# EAGLE design Dashcam_HAT (EAGLE 6.6.0)

## Sheet 1 of 2
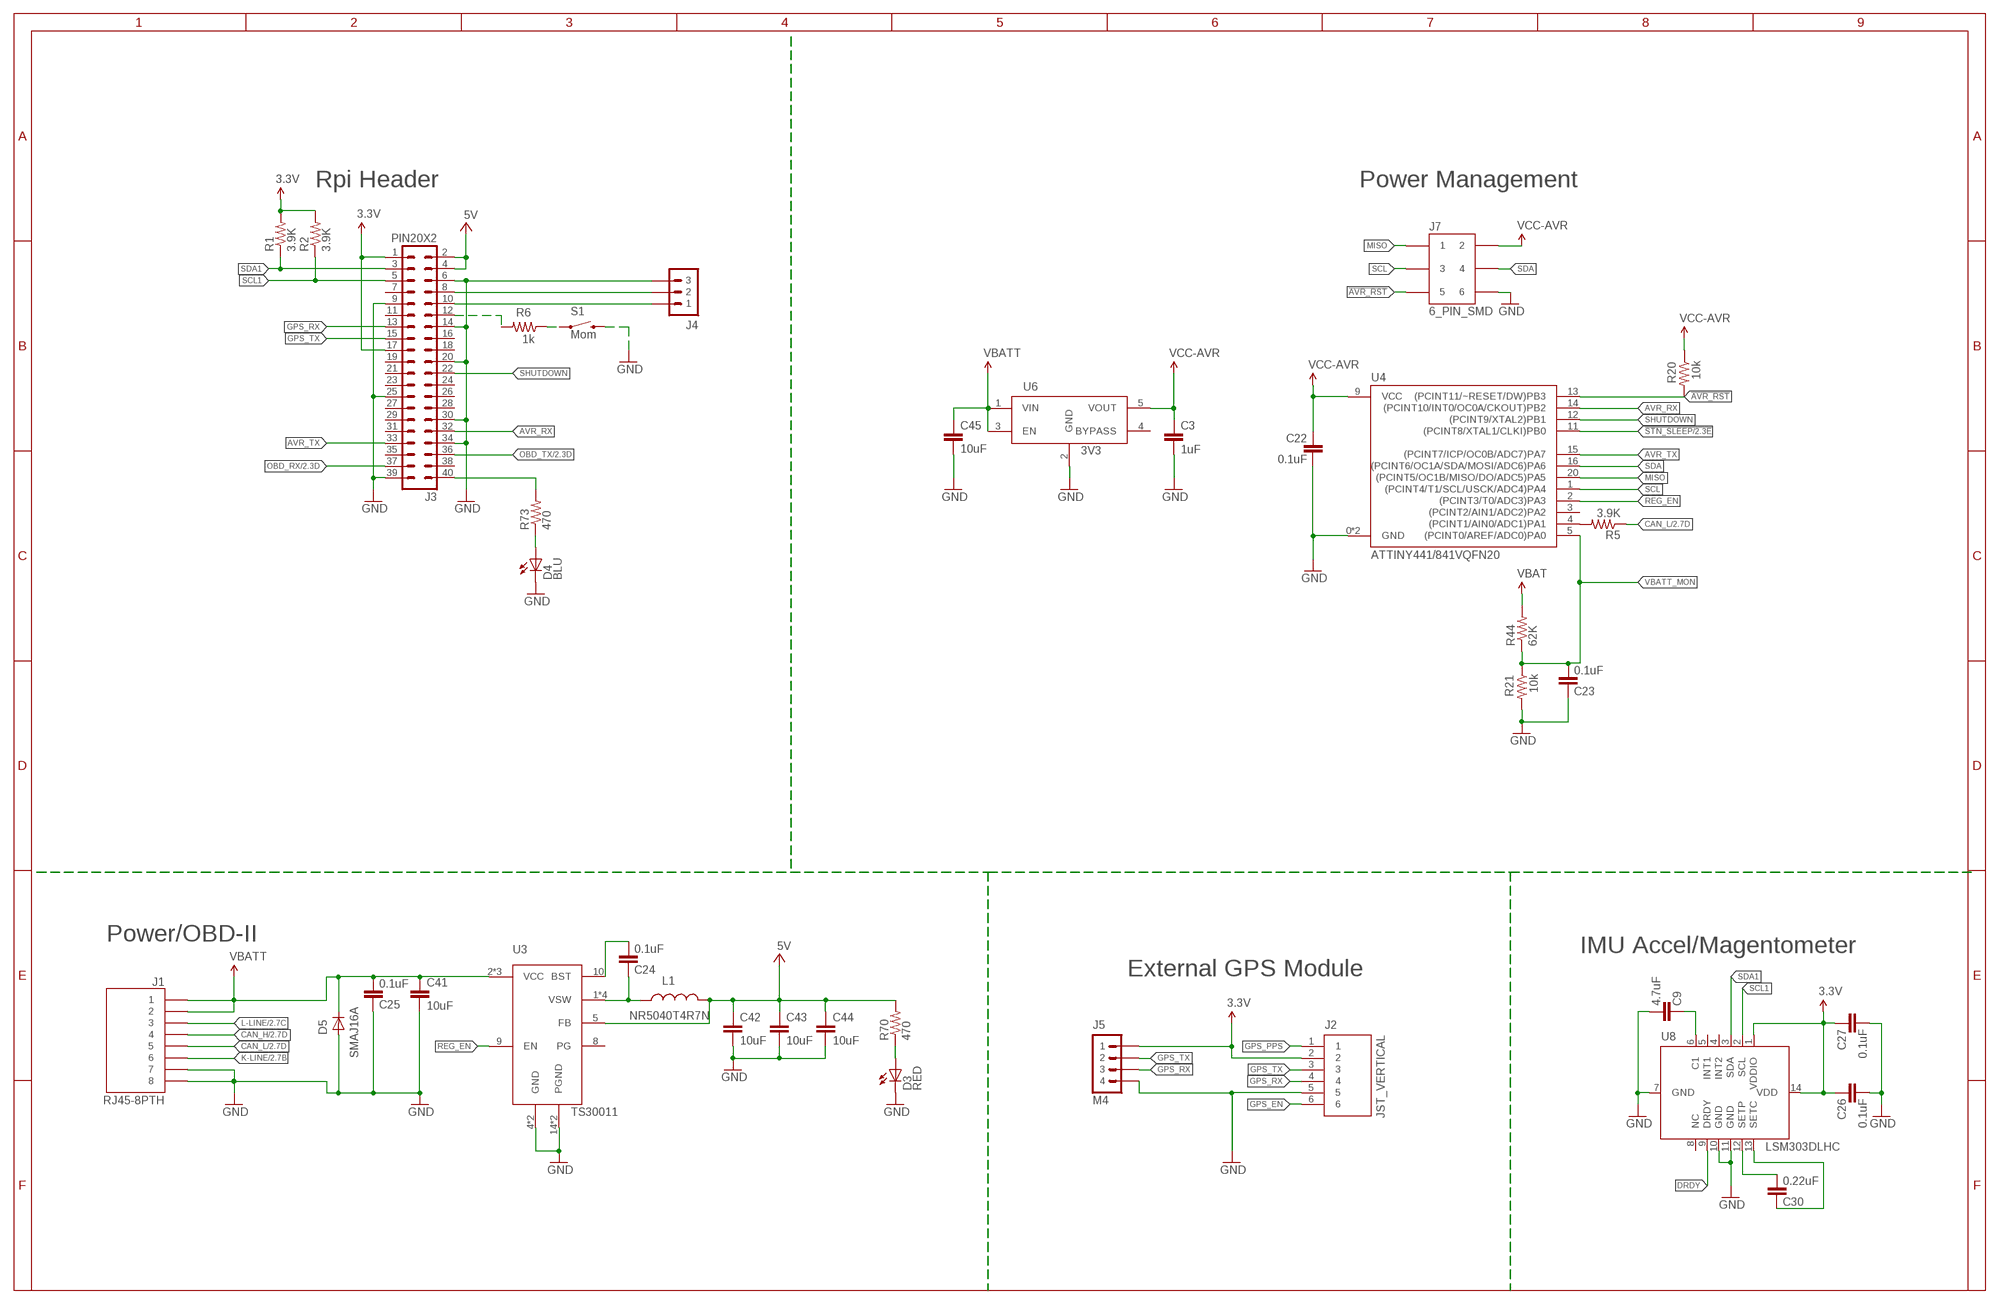
[diagram p0: schematic, sheet 1]

### Parts
C3  1uF  CAP0402-CAP  [0402-CAP]
C9  4.7uF  CAP0402-CAP  [0402-CAP]
C22  0.1uF  CAP0402-CAP  [0402-CAP]
C23  0.1uF  CAP0402-CAP  [0402-CAP]
C24  0.1uF  CAP0402-CAP  [0402-CAP]
C25  0.1uF  CAP0402-CAP  [0402-CAP]
C26  0.1uF  CAP0402-CAP  [0402-CAP]
C27  0.1uF  CAP0402-CAP  [0402-CAP]
C30  0.22uF  CAP0402-CAP  [0402-CAP]
C41  10uF  CAP1206  [1206]
C42  10uF  CAP1206  [1206]
C43  10uF  CAP1206  [1206]
C44  10uF  CAP1206  [1206]
C45  10uF  CAP1206  [1206]
D3  RED  LED0603  [LED_0603]
D4  BLU  LED0603  [LED_0603]
D5  SMAJ16A  DIODESMA  [SMA]
J1  RJ45-8PTH  [RJ45-8]
J2  JST_VERTICAL  [JST-6-SMD-VERT-1.0MM]
J3  PIN20X2  [PIN_20X2]
J4  M30.1"_LOCK  [M3X1_LOCK]
J5  M4  [M4X1_LOCK]
J7  6_PIN_SMD  6_PIN_PDISMD  [M3X2_SMD]
L1  NR5040T4R7N  [NR5040]
R1  3.9K  RESISTOR0402-RES  [0402-RES]
R2  3.9K  RESISTOR0402-RES  [0402-RES]
R5  3.9K  RESISTOR0402-RES  [0402-RES]
R6  1k  RESISTOR0402-RES  [0402-RES]
R20  10k  RESISTOR0402-RES  [0402-RES]
R21  10k  RESISTOR0402-RES  [0402-RES]
R44  62K  RESISTOR0402-RES  [0402-RES]
R70  470  RESISTOR0603-RES  [0603-RES]
R73  470  RESISTOR0603-RES  [0603-RES]
S1  Mom  SWITCH-MOMENTARY-2-SMD-1101NE  [TACTILE-SWITCH-1101NE]
U3  TS30011  [QFN-16]
U4  ATTINY441/841VQFN20  [QFN20_0.45MM]
U6  3V3  TC1XXXSOT23-5  [SOT23-5]
U8  LSM303DLHC  [LGA14]

### Nets
3.3V: C26.1 C27.1 J2.2 J3.1 J3.17 J5.1 R1.2 R2.2 U8.1(VDDIO) U8.14(VDD) ; also sheet 2
5V: C42.1 C43.1 C44.1 J3.2 J3.4 L1.P$2 R70.2 U3.5(FB) ; also sheet 2
!AVR_RST: J7.P$5 R20.2 U4.13((PCINT11/~RESET/DW)PB3)
!STN_SLEEP: U4.11((PCINT8/XTAL1/CLKI)PB0) ; also sheet 2
AVR_RX: J3.32 U4.14((PCINT10/INT0/OC0A/CKOUT)PB2)
AVR_TX: J3.33 U4.15((PCINT7/ICP/OC0B/ADC7)PA7)
BST: C24.2 U3.10(BST)
CAN_H: J1.4 ; also sheet 2
CAN_L: J1.5 R5.1 ; also sheet 2
DRDY: U8.9(DRDY)
GND: C3.2 C9.2 C22.2 C23.1 C25.1 C26.2 C27.2 C41.2 C42.2 C43.2 C44.2 C45.2 D3.C D4.C D5.A J1.7 J1.8 J2.5 J3.6 J3.9 J3.14 J3.20 J3.25 J3.30 J3.34 J3.39 J4.3 J5.4 J7.P$6 R21.2 S1.P$2 U3.4(GND) U3.14(PGND) U3.15(PGND) U3.EXP(GND) U4.0(GND) U4.8(GND) U6.2(GND) U8.7(GND) U8.10(GND) U8.11(GND) ; also sheet 2
GPS_EN: J2.6
GPS_PPS: J2.1
GPS_RX: J2.4 J3.13 J5.3
GPS_TX: J2.3 J3.15 J5.2
K-LINE: J1.6 ; also sheet 2
L-LINE: J1.3 ; also sheet 2
MISO: J7.P$1 U4.20((PCINT5/OC1B/MISO/DO/ADC5)PA5)
N$1: C9.1 U8.6(C1)
N$2: R5.2 U4.4((PCINT1/AIN0/ADC1)PA1)
N$12: D3.A R70.1
N$17: D4.A R73.1
N$18: C30.2 U8.12(SETP)
N$20: C30.1 U8.13(SETC)
N$23: J3.12 R6.2
N$24: R6.1 S1.P$1
OBD_RX: J3.37 ; also sheet 2
OBD_TX: J3.36 ; also sheet 2
REG_EN: U3.9(EN) U4.2((PCINT3/T0/ADC3)PA3)
SCL: J7.P$3 U4.1((PCINT4/T1/SCL/USCK/ADC4)PA4)
SCL1: J3.5 R2.1 U8.2(SCL)
SDA: J7.P$4 U4.16((PCINT6/OC1A/SDA/MOSI/ADC6)PA6)
SDA1: J3.3 R1.1 U8.3(SDA)
SHUTDOWN: J3.22 U4.12((PCINT9/XTAL2)PB1)
UART1_RX: J3.10 J4.1
UART1_TX: J3.8 J4.2
USER_LED: J3.40 R73.2
VBATT [VBATT]: C25.2 C41.1 C45.1 D5.K(C) J1.1 J1.2 R44.2 U3.2(VCC) U3.3(VCC) U3.11(VCC) U6.1(VIN) U6.3(EN) ; supply symbol labelled VBAT ; also sheet 2
VBATT_MON: C23.2 R21.1 R44.1 U4.5((PCINT0/AREF/ADC0)PA0)
VCC-AVR: C3.1 C22.1 J7.P$2 R20.1 U4.9(VCC) U6.5(VOUT)
VSW: C24.1 L1.P$1 U3.1(VSW) U3.12(VSW) U3.13(VSW) U3.16(VSW)
Unconnected: J3.7 J3.11 J3.16 J3.18 J3.19 J3.21 J3.23 J3.24 J3.26 J3.27 J3.28 J3.29 J3.31 J3.35 J3.38 U3.8(PG) U4.3((PCINT2/AIN1/ADC2)PA2) U6.4(BYPASS) U8.4(INT2) U8.5(INT1) U8.8(NC)

### Notes on the sheet
- Rpi Header | Power Management
- Power/OBD-II
- IMU Accel/Magentometer
- External GPS Module
- X

## Sheet 2 of 2
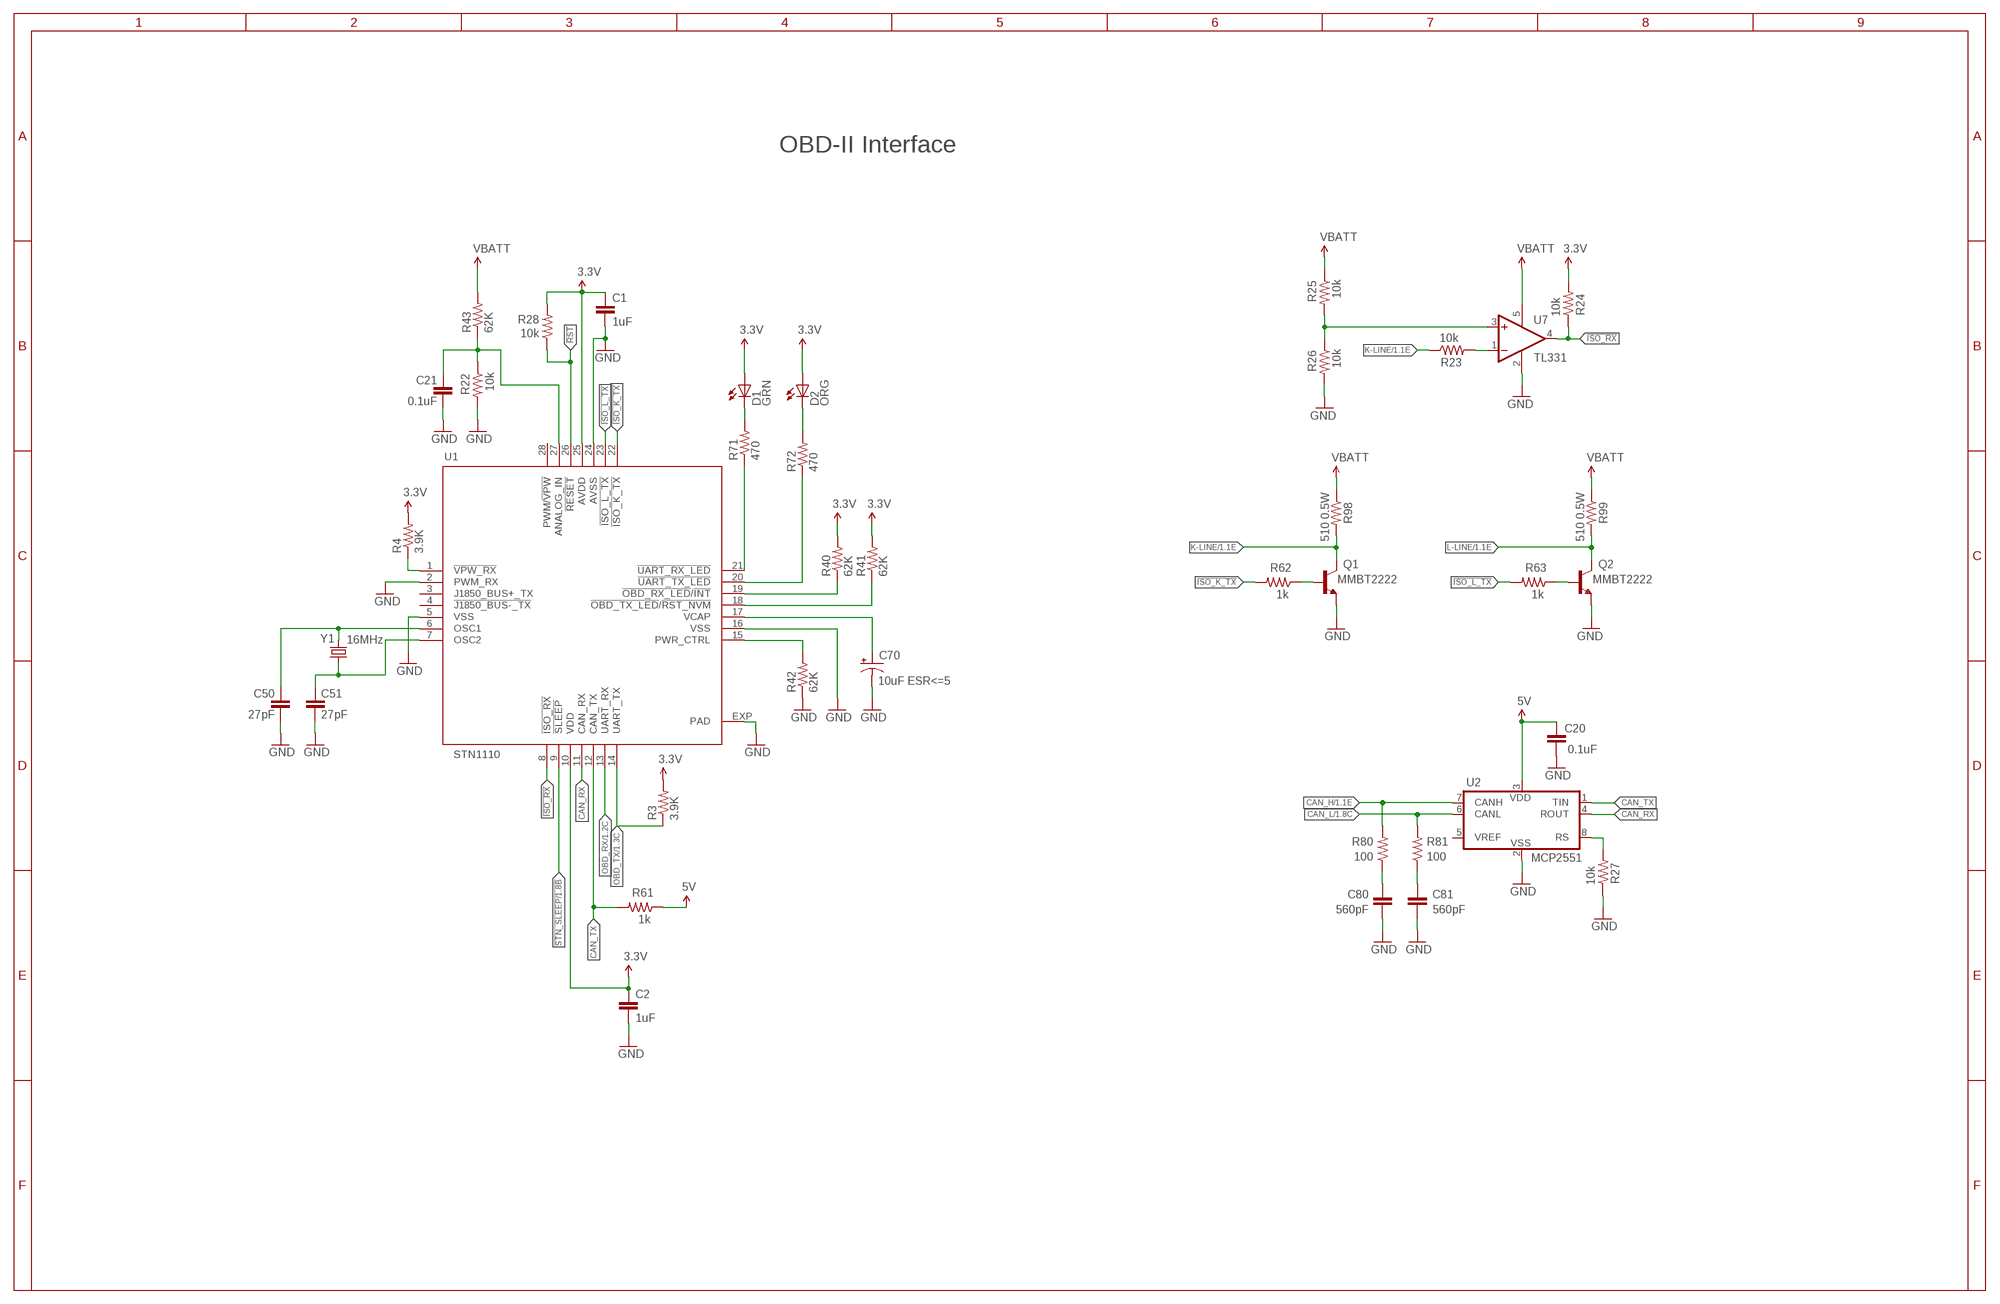
[diagram p1: schematic, sheet 2]

### Parts
C1  1uF  CAP0402-CAP  [0402-CAP]
C2  1uF  CAP0402-CAP  [0402-CAP]
C20  0.1uF  CAP0402-CAP  [0402-CAP]
C21  0.1uF  CAP0402-CAP  [0402-CAP]
C50  27pF  CAP0402-CAP  [0402-CAP]
C51  27pF  CAP0402-CAP  [0402-CAP]
C70  10uF ESR<=5  CAP_POL1206  [EIA3216]
C80  560pF  CAP0402-CAP  [0402-CAP]
C81  560pF  CAP0402-CAP  [0402-CAP]
D1  GRN  LED0603  [LED_0603]
D2  ORG  LED0603  [LED_0603]
Q1  MMBT2222  TRANSISTOR_NPNSOT23-3  [SOT23-3]
Q2  MMBT2222  TRANSISTOR_NPNSOT23-3  [SOT23-3]
R3  3.9K  RESISTOR0402-RES  [0402-RES]
R4  3.9K  RESISTOR0402-RES  [0402-RES]
R22  10k  RESISTOR0402-RES  [0402-RES]
R23  10k  RESISTOR0402-RES  [0402-RES]
R24  10k  RESISTOR0402-RES  [0402-RES]
R25  10k  RESISTOR0402-RES  [0402-RES]
R26  10k  RESISTOR0402-RES  [0402-RES]
R27  10k  RESISTOR0402-RES  [0402-RES]
R28  10k  RESISTOR0402-RES  [0402-RES]
R40  62K  RESISTOR0402-RES  [0402-RES]
R41  62K  RESISTOR0402-RES  [0402-RES]
R42  62K  RESISTOR0402-RES  [0402-RES]
R43  62K  RESISTOR0402-RES  [0402-RES]
R61  1k  RESISTOR0402-RES  [0402-RES]
R62  1k  RESISTOR0402-RES  [0402-RES]
R63  1k  RESISTOR0402-RES  [0402-RES]
R71  470  RESISTOR0603-RES  [0603-RES]
R72  470  RESISTOR0603-RES  [0603-RES]
R80  100  RESISTOR0402-RES  [0402-RES]
R81  100  RESISTOR0402-RES  [0402-RES]
R98  510 0.5W  R-US_2010  [2010]
R99  510 0.5W  R-US_2010  [2010]
U1  STN1110  SCANTOOL  [_STN_SCANTOOL_QFN-28-S]
U2  MCP2551  MCP2551-I/SN  [SO-8]
U7  TL331  [DBV-R-PDSO-G5]
Y1  16MHz  CRYSTAL5X3  [CRYSTAL-SMD-5X3]

### Nets
3.3V: C1.1 C2.1 D1.A D2.A R3.2 R4.2 R24.2 R28.2 R40.2 R41.2 U1.10(VDD) U1.25(AVDD) ; also sheet 1
5V: C20.1 R61.1 U2.3(VDD) ; also sheet 1
!ISO_K_TX: R62.2 U1.22(!ISO_K_TX)
!ISO_L_TX: R63.2 U1.23(!ISO_L_TX)
!ISO_RX: R24.1 U1.8(!ISO_RX) U7.4(OUT)
!RST: R28.1 U1.26(!RESET)
!STN_SLEEP: U1.9(!SLEEP) ; also sheet 1
BATT_V: C21.1 R22.1 R43.1 U1.27(ANALOG_IN)
CAN_H: R80.2 U2.7(CANH) ; also sheet 1
CAN_L: R81.2 U2.6(CANL) ; also sheet 1
CAN_RX: U1.11(CAN_RX) U2.4(ROUT)
CAN_TX: R61.2 U1.12(CAN_TX) U2.1(TIN)
GND: C1.2 C2.2 C20.2 C21.2 C50.2 C51.2 C70.C(-) C80.2 C81.2 Q1.2(E) Q2.2(E) R22.2 R26.2 R27.1 R42.1 U1.2(PWM_RX) U1.5(VSS) U1.16(VSS) U1.24(AVSS) U1.EXP(PAD) U2.2(VSS) U7.2(GND) ; also sheet 1
K-LINE: Q1.3(C) R23.1 R98.2 ; also sheet 1
L-LINE: Q2.3(C) R99.2 ; also sheet 1
N$3: R71.1 U1.21(!UART_RX_LED)
N$4: Q1.1(B) R62.1
N$5: Q2.1(B) R63.1
N$6: R25.2 R26.1 U7.3(+IN)
N$7: R72.1 U1.20(!UART_TX_LED)
N$8: R42.2 U1.15(PWR_CTRL)
N$9: R4.1 U1.1(!VPW_RX)
N$10: C80.1 R80.1
N$11: R27.2 U2.8(RS)
N$13: R23.2 U7.1(-IN)
N$14: R41.1 U1.18(!OBD_TX_LED!/!RST_NVM)
N$15: R40.1 U1.19(!OBD_RX_LED!/!INT)
N$26: C70.A(+) U1.17(VCAP)
N$27: C81.1 R81.1
N$35: D1.C R71.2
N$36: D2.C R72.2
OBD_RX: U1.13(UART_RX) ; also sheet 1
OBD_TX: R3.1 U1.14(UART_TX) ; also sheet 1
OSC1: C50.1 U1.6(OSC1) Y1.3
OSC2: C51.1 U1.7(OSC2) Y1.1
VBATT [VBATT]: R25.1 R43.2 R98.1 R99.1 U7.5(V+) ; also sheet 1
Unconnected: U1.3(J1850_BUS+_TX) U1.4(!J1850_BUS-_TX) U1.28(PWM/!VPW) U2.5(VREF)

### Notes on the sheet
- OBD-II Interface

## Library data of the parts
C1-C3 = SparkFun:CAP: Capacitor Standard 0603 ceramic capacitor, and 0.1" leaded capacitor.; DIGIKEY_PN: 490-3890-1-ND; MANUFACTURER: Murata; MFG_PN: GRM155R61A105KE15D
C9 = SparkFun:CAP: Capacitor Standard 0603 ceramic capacitor, and 0.1" leaded capacitor.; DIGIKEY_PN: 490-5915-1-ND; MANUFACTURER: Murata; MFG_PN: GRM155R60J475ME47D
C20-C27 = SparkFun:CAP: Capacitor Standard 0603 ceramic capacitor, and 0.1" leaded capacitor.; DIGIKEY_PN: 1276-1001-1-ND; MANUFACTURER: Samsung; MFG_PN: CL05B104KO5NNNC
C30 = SparkFun:CAP: Capacitor Standard 0603 ceramic capacitor, and 0.1" leaded capacitor.; DIGIKEY_PN: 490-5418-1-ND; MANUFACTURER: Murata; MFG_PN: GRM155R71C224KA12D
C41-C45 = SparkFun-Capacitors:CAP: Capacitor Standard 0603 ceramic capacitor, and 0.1" leaded capacitor.; DIGIKEY_PN: 1276-6767-1-ND; MANUFACTURER: Samsung; MFG_PN: CL31B106KBHNNNE
C50 = SparkFun:CAP: Capacitor Standard 0603 ceramic capacitor, and 0.1" leaded capacitor.; DIGIKEY_PN: 1276-1153-1-ND; MANUFACTURER: Samsung; MFG_PN: CL05C270JB5NNNC
C51 = SparkFun:CAP: Capacitor Standard 0603 ceramic capacitor, and 0.1" leaded capacitor.
C70 = SparkFun:CAP_POL: Capacitor Polarized These are standard SMD and PTH capacitors. Normally 10uF, 47uF, and 100uF in electrolytic and tantalum varieties. Always verify the external diameter of the through hole cap, it varies with capacity, voltage, and manufacturer. The EIA devices should be standard.; DIGIKEY_PN: 478-8237-1-ND; MANUFACTURER: AVX Corporation; MFG_PN: F931C106MAA
C80 C81 = SparkFun:CAP: Capacitor Standard 0603 ceramic capacitor, and 0.1" leaded capacitor.; DIGIKEY_PN: 1276-1577-1-ND; MANUFACTURER: Samsung; MFG_PN: CL05B561KB5NNNC
D1 = Jason_Library_1:LED: Surface mount LED; DIGIKEY_PN: 160-1183-1-ND; MANUFACTURER: Lite-On Inc; MFG_PN: LTST-C190GKT
D2 = Jason_Library_1:LED: Surface mount LED; DIGIKEY_PN: 160-1434-1-ND; MANUFACTURER: Lite-On Inc; MFG_PN: LTST-C190KFKT
D3 = Jason_Library_1:LED: Surface mount LED; DIGIKEY_PN: 160-1436-1-ND; MANUFACTURER: Lite-On Inc; MFG_PN: LTST-C190KRKT
D4 = Jason_Library_1:LED: Surface mount LED; DIGIKEY_PN: 160-1646-1-ND; MANUFACTURER: Lite-On Inc; MFG_PN: LTST-C190TBKT
D5 = Jason_Library_1:DIODE: General purpose diode; DIGIKEY_PN: SMAJ16ALFCT-ND; MANUFACTURER: Littlefuse; MFG_PN: SMAJ16A
J1 = SparkFun-Connectors:RJ45-8: RJ45 Jack Simple RJ45, 8-pin connection - connector for common Cat5, Cat5e, and Cat6 Ethernet cables. Footprint not yet proven in production. Connector sku is PRT-00643; Breakout PCB sku is BOB-00716.; DIGIKEY_PN: 609-1046-ND; MANUFACTURER: Amphenol FCI; MFG_PN: 54602-908LF
J2 = SparkFun-Connectors:JST_VERTICAL; DIGIKEY_PN: 455-1792-1-ND; MANUFACTURER: JST; MFG_PN: BM06B-SRSS-TB(LF)(SN); PROD_ID: CONN-08249
J3 = FLYFISH:PIN20X2; DIGIKEY_PN: SAM9315-ND; MANUFACTURER: Samtec Inc; MFG_PN: ESQ-120-23-T-D
J4 = Jason_Connector:M3: 3 pin header
J5 = Jason_Connector:M4: 4 pin 0.1" pitch header
J7 = Jason_Connector:6_PIN_PDI: 6 pin PDI programming header; DIGIKEY_PN: 609-3693-1-ND; MANUFACTURER: Amphenol FCI; MFG_PN: 20021121-00006C4LF
L1 = Jason_Library_1:NR5040T4R7N: Taiyo Yuden Inductor Datasheet <http://ds.yuden.co.jp/TYCOMPAS/ut/detail.do?productNo=NR5040T4R7N&fileName=NR5040T4R7N_SS&mode=specSheetDownload>; DIGIKEY_PN: 587-2373-1-ND; MANUFACTURER: Taiyo Yuden; MFG_PN: 587-2373-1-ND
Q1 Q2 = SparkFun:TRANSISTOR_NPN: Transistor NPN BJT configuration in SOT23 package. MMBT2222 is the common NPN we use. Double check BCE configuration again layout.; DIGIKEY_PN: MMBT2222ALT1GOSCT-ND; MANUFACTURER: ON Semiconductor; MFG_PN: MMBT2222ALT1G
R1-R5 = SparkFun-Passives:RESISTOR: Resistor Basic schematic elements and footprints for 0603, 1206, and PTH resistors.; DIGIKEY_PN: 311-3.9KJRCT-ND; MANUFACTURER: Yageo; MFG_PN: RC0402JR-073K9L
R6 R61-R63 = SparkFun:RESISTOR: Resistor Basic schematic elements and footprints for 0603, 1206, and PTH resistors.; DIGIKEY_PN: 311-1.0KJRCT-ND; MANUFACTURER: Yageo; MFG_PN: RC0402JR-071KL
R20-R27 = SparkFun:RESISTOR: Resistor Basic schematic elements and footprints for 0603, 1206, and PTH resistors.; DIGIKEY_PN: 311-10KJRCT-ND; MANUFACTURER: Yageo; MFG_PN: RC0402JR-0710KL
R28 = SparkFun:RESISTOR: Resistor Basic schematic elements and footprints for 0603, 1206, and PTH resistors.
R40-R44 = SparkFun:RESISTOR: Resistor Basic schematic elements and footprints for 0603, 1206, and PTH resistors.; DIGIKEY_PN: 311-62.0KLRCT-ND; MANUFACTURER: Yageo; MFG_PN: RC0402FR-0762KL
R70-R73 = SparkFun-Passives:RESISTOR: Resistor Basic schematic elements and footprints for 0603, 1206, and PTH resistors.; DIGIKEY_PN: 311-470JRCT-ND; MANUFACTURER: Yageo; MFG_PN: RC0402JR-07470RL
R80 R81 = SparkFun:RESISTOR: Resistor Basic schematic elements and footprints for 0603, 1206, and PTH resistors.; DIGIKEY_PN: 311-100JRCT-ND; MANUFACTURER: Yageo; MFG_PN: RC0402JR-07100RL
R98 R99 = _stn_rcl:R-US: Resistor, US Symbol Change Log Date Author Change November 13, 2006 vit@scantool.net Moved underscore from the end of device name to beginning of variant names. May 27, 2006 vitaliy@scantool.net Added description.; DESC: Resistor; DIGIKEY_PN: RHM510BGCT-ND; MANUFACTURER: Rohm Semiconductor; MFG_PN: MCR50JZHJ511; VALSTAT: VAL
S1 = SparkFun:SWITCH-MOMENTARY-2; DIGIKEY_PN: P13597SCT-ND; MANUFACTURER: Panasonic; MFG_PN: EVQ-PNF04M
U1 = SparkFun:SCANTOOL: STN1110 - Multiprotocol OBD II to UART Interpreter, QFN Package Change Log Date Author Change Aug 23, 2010 vit@scantool.net Created device
U2 = _stn_microchip:MCP2551: CAN Driver Based on information from the MPC2551 datasheet from Microchip. http://www.microchip.com/ Change Log Date Author Change November 12, 2008 joe@scantool.net Renamed "TXD" to "TIN" and "RXD" to "ROUT" Fixed mislabeled pins "CANH" and CANL"; DESC: IC, CAN Transceiver; DIGIKEY_PN: MCP2551T-E/SNCT-ND; MANUF: Microchip Technology; MANUFACTURER: Microchip Technology; MFG_PN: MCP2551T-E/SN; PARTNUM: MCP2551-I/SN; SUPPLIER: Digikey:MCP2551-I/SN-ND; VALSTAT: PARTNUM
U3 = Jason_Library_1:TS30011: Semtech High Efficiency 1A/2A/3A Current-Mode Synchronous Buck DC/DC Converter Datasheet <http://www.semtech.com/images/datasheet/ts30011_12_13.pdf>; DIGIKEY_PN: TS30013-M050QFNRCT-ND; MANUFACTURER: Semtech; MFG_PN: TS30013-M050QFNR
U4 = Jason_Library_1:ATTINY441/841: ATtiny441/841 8-bit AVR Microcontroller with 4/8K Bytes In-System Flash; DIGIKEY_PN: ATTINY841-MMH-ND; MANUFACTURER: Atmel; MFG_PN: ATTINY841-MMH
U6 = Jason_Library_1:TC1XXX: TC1014/TC1015/TC1185 voltage regulator; DIGIKEY_PN: AP2204K-3.3TRG1DICT-ND; MANUFACTURER: Diodes Inc; MFG_PN: AP2204K-3.3TRG1
U7 = linear:TL331: SINGLE DIFFERENTIAL COMPARATOR Source: Data sheet <http://www.ti.com/lit/ds/symlink/tl331-q1.pdf>; DIGIKEY_PN: 296-10168-1-ND; MANUFACTURER: Texas Instruments; MFG_PN: TL331IDBVR
U8 = microbuilder:LSM303DLHC: LSM303DLHC 3-Axis I2C Accelerometer and 3-Axis Magnetometer VDD: 2.2-3.6V VDDIO: 1.8-VDD Magnetic Range: +/-1.3 to +/-8.1 gauss Accel Range: +/-2/4/8/16 g Temp: -40 - 85°C; DIGIKEY_PN: 497-11918-1-ND; MANUFACTURER: STMicroelectronics; MFG_PN: LSM303DLHCTR
Y1 = SparkFun:CRYSTAL: Crystals Various standard crystals. Proven footprints. Spark Fun Electronics SKU : COM-00534; DIGIKEY_PN: 535-9122-1-ND; MANUFACTURER: Abracon LLC; MFG_PN: ABM3B-16.000MHZ-B2-T

## Net classes
1 VBATT: width 0.406 mm, clearance 0.254 mm

## Board
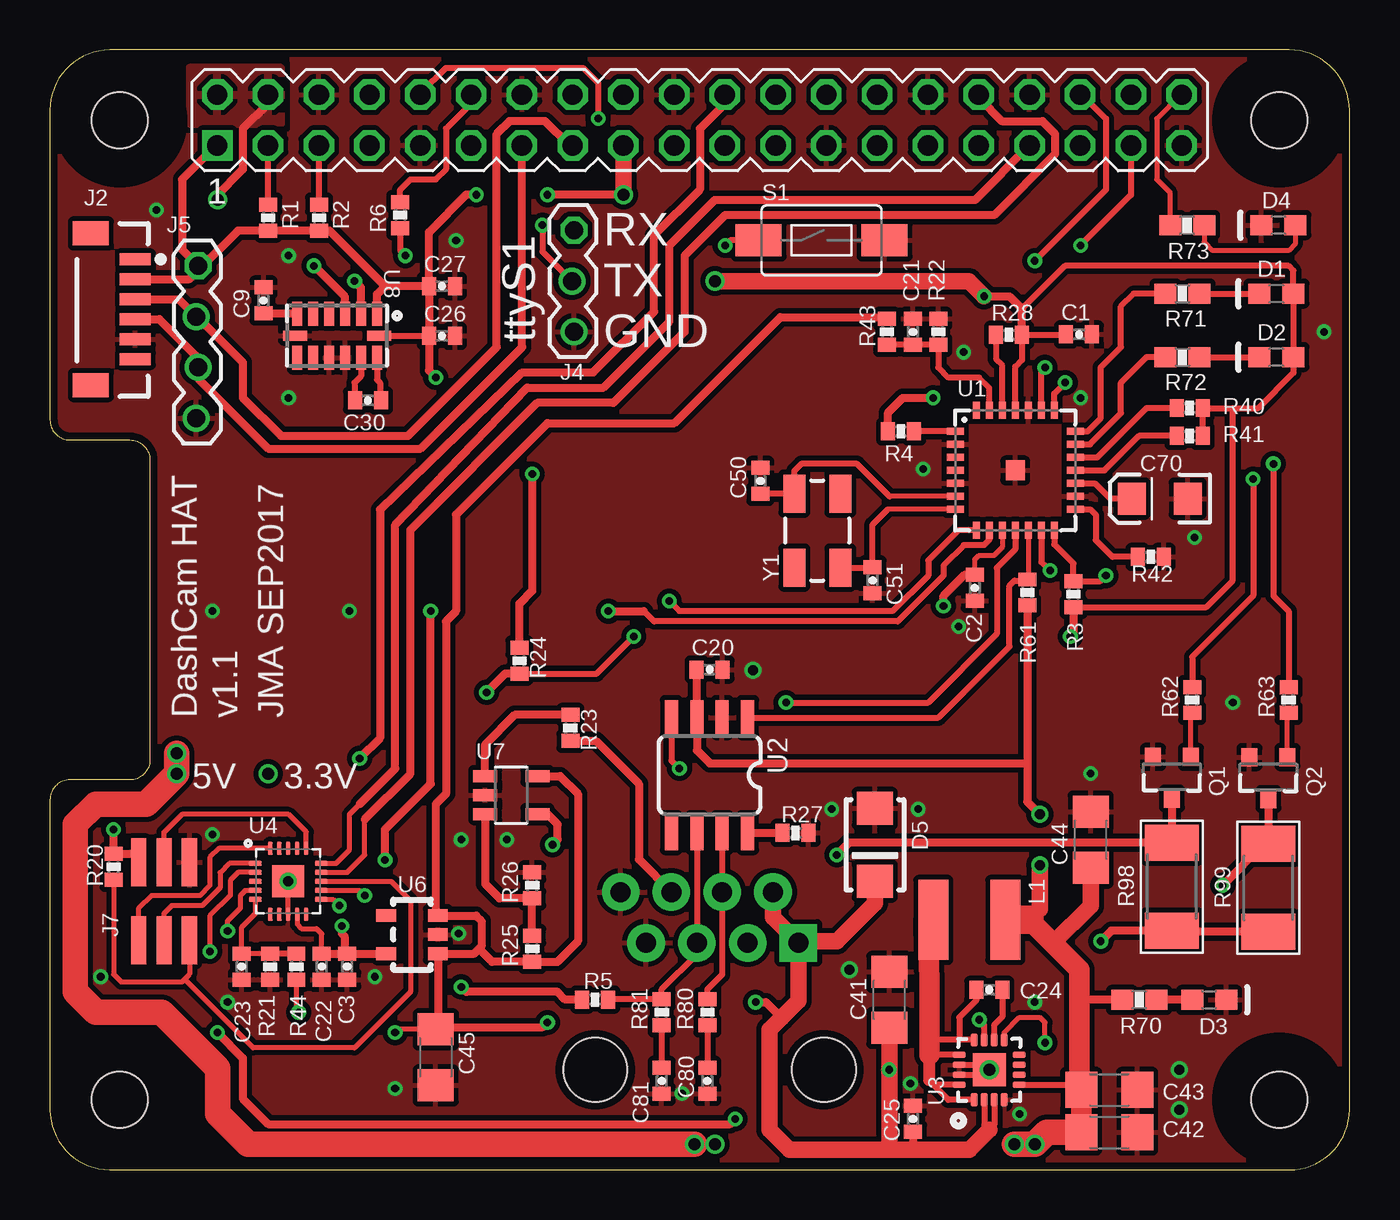
[diagram p2: board, top side]
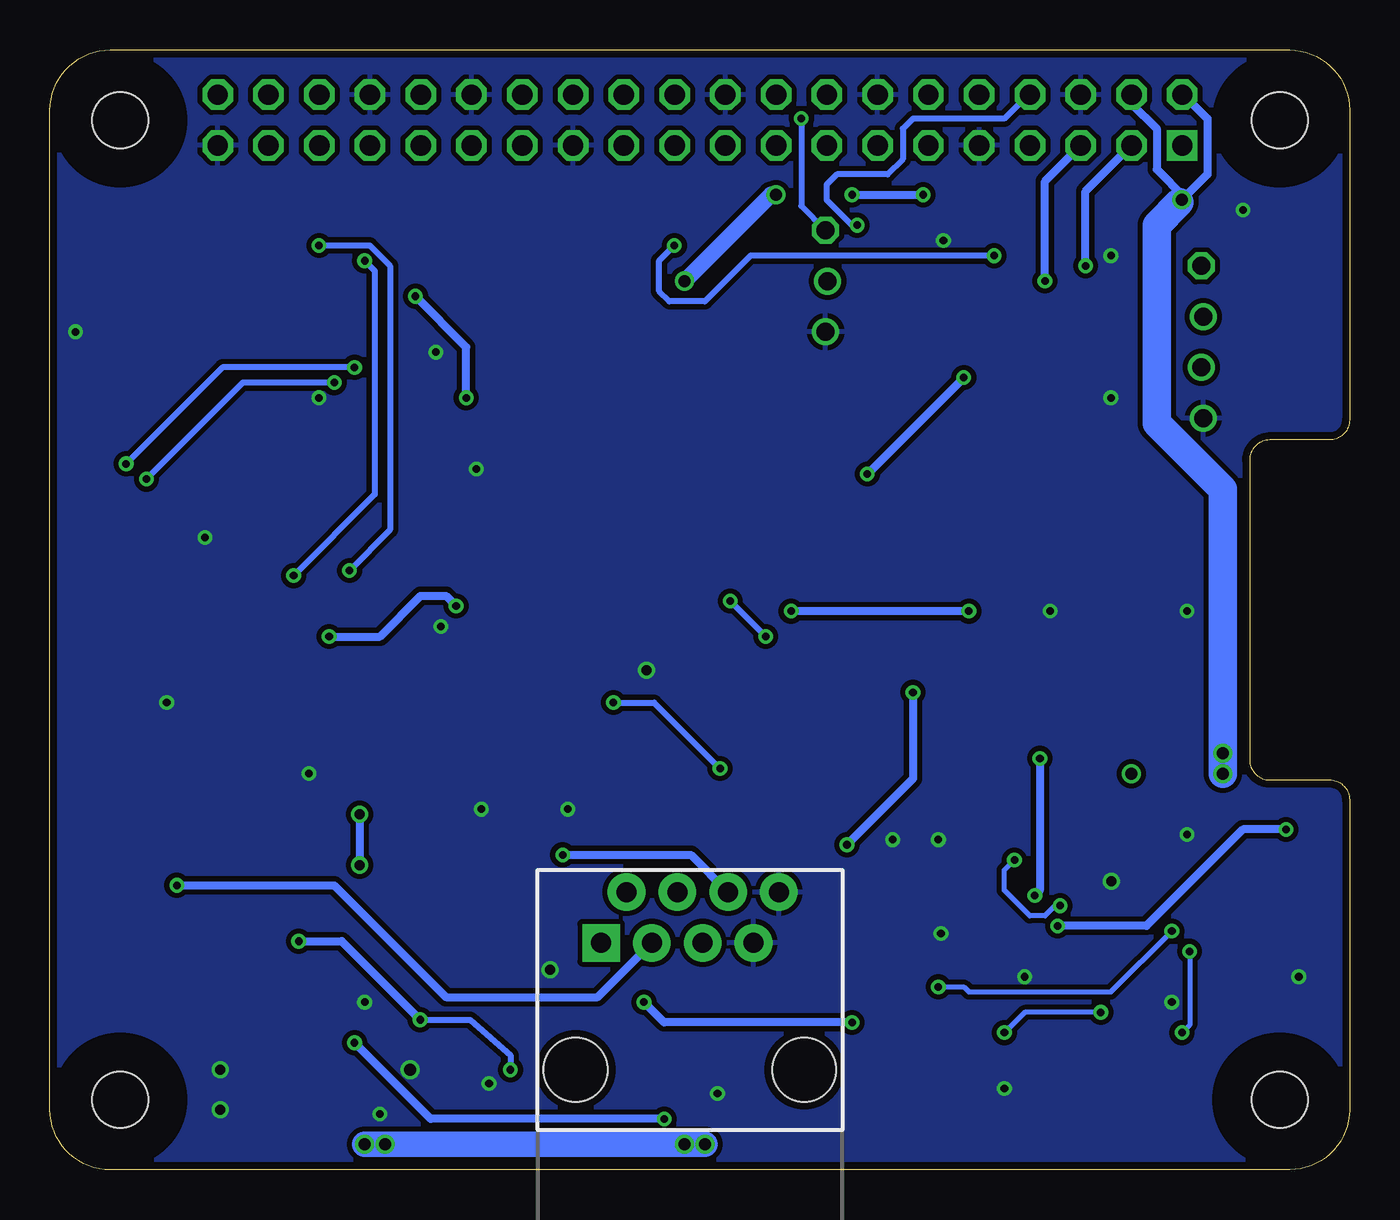
[diagram p3: board, bottom side, seen from below]

Size 65.02 x 56.01 mm. Coordinates in mm from the lower left corner, seen from the top.
Outline: 0,3 arc90 3,0 62,0 arc90 65.02,3 65.02,53 arc90 62,56.01 3,56.01 arc90 0,53 0,37.5 arc90 1,36.5 4,36.5 arc-90 5,35.5 5,20.5 arc-90 4,19.5 1,19.5 arc90 0,18.5 0,3
Copper layers (1*16): Top 0.0356mm / dielectric 1.5011mm / Bottom 0.0356mm
Design rules "oshpark-2layer *": minimum track width 6mil, minimum drill 13mil, track to track 6mil, track to pad 6mil, pad to pad 6mil, via to via 6mil, smd to smd 6mil, copper to edge 15mil, drill to drill 6mil, minimum pad ring 7mil, minimum via ring 7mil, stop-mask expansion 2.5mil, vias tented up to drill 16mil, thermal gap 10mil
Holes 2.8 mm at 3.5,3.5 3.5,52.5 61.5,52.5 61.5,3.5
bKeepout: area 43,0 to 47,20
tRestrict: area 1.9,51 to 5,54; area 60,51 to 63,54; area 60,1.9 to 63,5; area 1.9,1.9 to 5,5; area 46.3,5.8 to 47.8,6.1; area 46.2,3.9 to 47.7,4.2; area 47.8,4.2 to 48.1,5.7; area 45.9,4.3 to 46.2,5.8; area 12.7,13.7 to 13.2,15.2; area 11.2,15.2 to 12.7,15.7; area 10.7,13.7 to 11.2,15.2; area 11.2,13.2 to 12.7,13.7
bRestrict: area 1.9,1.9 to 5,5; area 1.9,51 to 5,54; area 60,1.9 to 63,5; area 60,51 to 63,54

### Footprints (pad centres in the part's own frame; a part is rotated, then mirrored left to right if it is on the bottom)
0402-CAP = smd 0.7 x 0.9: 1 -0.65,0; 2 0.65,0
1206 = smd 1.6 x 1.8: 1 -1.4,0; 2 1.4,0
EIA3216 = smd 1.4 x 1.6: A 1.4,0; C -1.4,0
LED_0603 = smd 1.1 x 1: A -0.85,0; C 0.85,0
SMA = smd 1.651 x 1.803: A 1.816,0; K -1.816,0
RJ45-8 = drill 1 pad 1.88 square: 1 -4.445,6.35 | drill 1 pad 1.88: 2 -3.175,8.89; 3 -1.905,6.35; 4 -0.635,8.89; 5 0.635,6.35; 6 1.905,8.89; 7 3.175,6.35; 8 4.445,8.89 | hole 3.2: -5.715,0; 5.715,0
JST-6-SMD-VERT-1.0MM = smd 0.6 x 1.55: 1 -2.54,1.27; 2 -1.54,1.27; 3 -0.54,1.27; 4 0.46,1.27; 5 1.46,1.27; 6 2.46,1.27 | smd 1.2 x 1.8: P$1 -3.84,-0.955; P$2 3.76,-0.955
PIN_20X2 = drill 1.016 square: 1 -24.13,-1.27 | drill 1.016 octagon: 2 -24.13,1.27; 3 -21.59,-1.27; 4 -21.59,1.27; 5 -19.05,-1.27; 6 -19.05,1.27; 7 -16.51,-1.27; 8 -16.51,1.27; 9 -13.97,-1.27; 10 -13.97,1.27; 11 -11.43,-1.27; 12 -11.43,1.27; 13 -8.89,-1.27; 14 -8.89,1.27; 15 -6.35,-1.27; 16 -6.35,1.27; 17 -3.81,-1.27; 18 -3.81,1.27; 19 -1.27,-1.27; 20 -1.27,1.27; 21 1.27,-1.27; 22 1.27,1.27; 23 3.81,-1.27; 24 3.81,1.27; 25 6.35,-1.27; 26 6.35,1.27; 27 8.89,-1.27; 28 8.89,1.27; 29 11.43,-1.27; 30 11.43,1.27; 31 13.97,-1.27; 32 13.97,1.27; 33 16.51,-1.27; 34 16.51,1.27; 35 19.05,-1.27; 36 19.05,1.27; 37 21.59,-1.27; 38 21.59,1.27; 39 24.13,-1.27; 40 24.13,1.27
M3X1_LOCK = drill 0.9 octagon: 1 0,0.051 | drill 0.9: 2 2.54,-0.051; 3 5.08,0.051
M4X1_LOCK = drill 0.9 octagon: 1 0,0.051 | drill 0.9: 2 2.54,-0.051; 3 5.08,0.051; 4 7.62,-0.051
M3X2_SMD = smd 0.762 x 2.388: P$1 -1.27,-1.951; P$2 -1.27,1.951; P$3 0,-1.951; P$4 0,1.951; P$5 1.27,-1.951; P$6 1.27,1.951
NR5040 = smd 1.5 x 4: P$1 -1.8,0; P$2 1.8,0
SOT23-3 = smd 0.8 x 0.9: 1 -0.95,-1; 2 0.95,-1; 3 0,1.1
0402-RES = smd 0.7 x 0.9: 1 -0.65,0; 2 0.65,0
0603-RES = smd 1.1 x 1: 1 -0.85,0; 2 0.85,0
2010 = smd 1.8 x 2.7: 1 -2.2,0; 2 2.2,0
TACTILE-SWITCH-1101NE = smd 2.3 x 1.6: P$1 -3.15,0; P$2 3.15,0
_STN_SCANTOOL_QFN-28-S = smd 0.85 x 0.35: 1 -3,1.95; 2 -3,1.3; 3 -3,0.65; 4 -3,0; 5 -3,-0.65; 6 -3,-1.3; 7 -3,-1.95; 15 3,-1.95; 16 3,-1.3; 17 3,-0.65; 18 3,0; 19 3,0.65; 20 3,1.3; 21 3,1.95 | smd 0.35 x 0.85: 8 -1.95,-3; 9 -1.3,-3; 10 -0.65,-3; 11 0,-3; 12 0.65,-3; 13 1.3,-3; 14 1.95,-3; 22 1.95,3; 23 1.3,3; 24 0.65,3; 25 0,3; 26 -0.65,3; 27 -1.3,3; 28 -1.95,3 | smd 1 x 1: EXP 0,0
SO-8 = smd 0.65 x 1.75: 1 -1.905,-2.873; 2 -0.635,-2.873; 3 0.635,-2.873; 4 1.905,-2.873; 5 1.905,2.873; 6 0.635,2.873; 7 -0.635,2.873; 8 -1.905,2.873
QFN-16 = smd 0.648 x 0.338: 1 -1.5,0.75 | smd 0.648 x 0.339: 2 -1.5,0.25; 3 -1.5,-0.25; 4 -1.5,-0.75; 9 1.5,-0.75; 10 1.5,-0.25; 11 1.5,0.25; 12 1.5,0.75 | smd 0.338 x 0.648: 5 -0.75,-1.5; 6 -0.25,-1.5; 15 -0.25,1.5; 16 -0.75,1.5 | smd 0.339 x 0.648: 7 0.25,-1.5; 8 0.75,-1.5; 13 0.75,1.5; 14 0.25,1.5 | smd 1.65 x 1.65: EXP 0,0
QFN20_0.45MM = smd 1.6 x 1.6: 0 0,0 | smd 0.65 x 0.241: 1 -1.65,0.9; 2 -1.65,0.45; 3 -1.65,0; 4 -1.65,-0.45; 5 -1.65,-0.9; 11 1.65,-0.9; 12 1.65,-0.45; 13 1.65,0; 14 1.65,0.45; 15 1.65,0.9 | smd 0.241 x 0.65: 6 -0.9,-1.65; 7 -0.45,-1.65; 8 0,-1.65; 9 0.45,-1.65; 10 0.9,-1.65; 16 0.9,1.65; 17 0.45,1.65; 18 0,1.65; 19 -0.45,1.65; 20 -0.9,1.65
SOT23-5 = smd 0.991 x 0.635: 1 -1.295,0.953; 2 -1.295,0; 3 -1.295,-0.953; 4 1.295,-0.953; 5 1.295,0.953
DBV-R-PDSO-G5 = smd 0.6 x 1.2: 1 -0.95,-1.306; 2 0,-1.306; 3 0.95,-1.306; 4 0.95,1.306; 5 -0.95,1.306
LGA14 = smd 0.5 x 1.2: 1 2,1.1; 2 1.2,1.1; 3 0.4,1.1; 4 -0.4,1.1; 5 -1.2,1.1; 6 -2,1.1; 8 -2,-1.1; 9 -1.2,-1.1; 10 -0.4,-1.1; 11 0.4,-1.1; 12 1.2,-1.1; 13 2,-1.1 | smd 1.2 x 0.5: 7 -2.1,0; 14 2.1,0
CRYSTAL-SMD-5X3 = smd 1.9 x 1.1: 1 -1.85,-1.15; 2 1.85,-1.15; 3 1.85,1.15; 4 -1.85,1.15

### Placement (x,y rotation side)
C1  51.49,41.78 0 top
C2  46.27,29.1 270 top
C3  14.87,10.16 270 top
C9  10.69,43.48 90 top
C20  33,25.02 0 top
C21  43.18,41.91 90 top
C22  13.6,10.16 270 top
C23  9.59,10.16 90 top
C24  47,9 0 top
C25  43.18,2.54 270 top
C26  19.61,41.71 0 top
C27  19.61,44.2 0 top
C30  15.91,38.48 180 top
C41  42,8.5 90 top
C42  53,1.87 0 top
C43  53,4 0 top
C44  52.07,16.51 90 top
C45  19.3,5.62 270 top
C50  35.55,34.46 90 top
C51  41.16,29.48 270 top
C70  55.52,33.56 180 top
C80  32.89,4.45 270 top
C81  30.61,4.45 270 top
D1  61.36,43.81 180 top
D2  61.36,40.64 180 top
D3  58,8.5 0 top
D4  61.47,47.24 180 top
D5  41.27,16.26 90 top
J1  33,5 0 bottom
J2  3,43 270 top
J3  32.5,52.5 0 top
J4  26.16,46.99 270 top
J5  7.37,45.21 270 top
J7  5.71,13.43 0 top
L1  46,12.5 0 top
Q1  56.13,19.66 180 top
Q2  60.96,19.64 180 top
R1  10.92,47.62 270 top
R2  13.46,47.62 270 top
R3  51.21,28.79 270 top
R4  42.58,36.94 180 top
R5  27.28,8.51 180 top
R6  17.53,47.75 90 top
R20  3.19,15.15 270 top
R21  11.01,10.16 270 top
R22  44.45,41.91 90 top
R23  26.04,22.1 90 top
R24  23.5,25.46 90 top
R25  24.13,11.05 90 top
R26  24.13,14.22 90 top
R27  37.31,16.85 180 top
R28  47.98,41.76 0 top
R40  57.02,38.1 0 top
R41  57.02,36.7 0 top
R42  55.08,30.66 180 top
R43  41.88,41.91 90 top
R44  12.33,10.16 270 top
R61  48.9,28.87 90 top
R62  57.15,23.5 90 top
R63  61.98,23.5 90 top
R70  54.5,8.5 180 top
R71  56.67,43.81 0 top
R72  56.67,40.64 0 top
R73  56.9,47.24 180 top
R80  32.89,7.87 90 top
R81  30.61,7.87 90 top
R98  56.13,14.16 90 top
R99  60.96,14.1 90 top
S1  38.61,46.48 0 top
U1  48.3,34.98 0 top
U2  33,19.74 180 top
U3  47,5 90 top
U4  11.92,14.43 0 top
U6  18.11,11.76 180 top
U7  23.08,18.74 270 top
U8  14.37,41.72 0 top
Y1  38.39,31.97 90 top

### Tracks (layer width: path | path; a pad name or v marks a point on that pad's centre or on a via)
3.3V  (via drill 0.38, 0.6)
  Top 0.254: U1.10 47.65,31.14 47.24,30.73 46.48,30.73 46.27,30.52 C2.1
  Top 0.305: U8.14 18.93,41.72 C26.1 | U1.25 48.3,40.17 48.63,40.51 R28.2 50.83,41.76 C1.1 | R41.2 R40.2 59.18,38.1 | 59.18,38.1 60.45,38.1 62.21,39.86 D2.A D1.A 62.21,44.97 61.98,45.21 50.79,45.21 48.63,43.06 | R3.2 57.85,28.14 59.18,29.46 59.18,38.1
  Top 0.406: J2.2 6.98,44.54 7.42,44.98 | 7.42,44.98 9.41,46.98 R1.2 R2.2 13.98,46.98 16.76,44.2 | U8.1 16.37,43.8 16.76,44.2 | C27.1 16.76,44.2 | C27.1 C26.1 18.96,39.97 v19.3,39.62 | 28.69,49.03 v28.7,48.77 v24.89,48.77 | v21.34,48.77 20.83,48.77 18.96,46.9 C27.1 | 7.42,44.98 J5.1 6.6,46.02 6.6,49.53 8.3,51.23 J3.1 | v24.13,34.8 24.13,28.96 23.5,28.32 R24.2 | R4.2 41.93,37.87 42.67,38.61 v44.2,38.61 | v46.74,43.69 48.01,43.69 48.63,43.06 R28.2 | R3.2 51.21,26.82 v51.05,26.67 | v44.7,28.19 44.7,28.7 45.76,29.75 C2.1
  Top 0.813: J3.17 28.69,49.03 | v33.27,44.45 45.97,44.45 v46.74,43.69
  Bottom 0.406: v24.89,48.77 v21.34,48.77 | v19.3,39.62 v24.13,34.8 | v44.2,38.61 44.2,41.15 v46.74,43.69 | v51.05,26.67 48.51,26.67 46.48,28.7 45.21,28.7 v44.7,28.19
  Bottom 0.813: v28.7,48.77 28.96,48.77 v33.27,44.45
5V  (via drill 0.5, 0.6)
  Top 0.305: U3.5 51.35,4.25 C43.1
  Top 0.406: R70.2 51.5,8.5 | R61.1 48.9,20.32 | 48.9,20.32 48.9,18.41 v49.53,17.78 | 48.9,20.32 33.02,20.32 32.37,20.97 U2.3 32.37,24.91 C20.1 | 8.26,48.64 9.65,50.04 9.65,52.07 10.91,53.33 J3.4
  Top 0.813: C44.1 52.07,13.21 50.18,11.32 | v49.53,15.24 49.53,13.03 49,12.5
  Top 1.016: 49,12.5 50.18,11.32 51.5,10 51.5,8.5 51.5,4.1 C43.1 C42.1
  Top 1.27: C42.1 49.88,1.87 v49.28,1.27 v48.26,1.27 | v32.26,1.27 9.91,1.27 8.38,2.79 8.38,5.08 5.59,7.87 2.29,7.87 1.27,8.89 1.27,17.27 2.29,18.29 4.83,18.29 v6.35,19.81 v6.35,20.83
  Top 1.422: L1.P$2 49,12.5
  Bottom 0.406: v49.53,17.78 v49.53,15.24 | J3.2 8.3,53.77 7.11,52.58 7.11,49.78 8.26,48.64 | 8.26,48.64 v8.38,48.51 8.51,48.39 | 8.26,48.64 9.65,50.04 9.65,52.07 10.91,53.33 J3.4
  Bottom 1.27: v32.26,1.27 v33.27,1.27 v49.28,1.27
  Bottom 1.422: v6.35,19.81 6.35,34.04 9.65,37.34 9.65,47.24 8.51,48.39
  pour Top (isolate 0.254): 6.99,55.12 6.99,52.32 11.56,52.32 11.56,55.12
!AVR_RST
  Top 0.254: R20.2 3.19,9.77 3.56,9.4 6.6,9.4 6.73,9.53 | 6.73,9.53 6.98,9.78 J7.P$5 | 6.73,9.53 10.16,6.1 15.24,6.1 18.03,8.89 18.03,13.46 17.07,14.43 U4.13
!ISO_K_TX  (via drill 0.38)
  Top 0.305: U1.22 50.25,38.82 v50.8,39.37 | v60.2,34.54 60.2,28.7 57.15,25.65 R62.2
  Bottom 0.305: v50.8,39.37 55.37,39.37 v60.2,34.54
!ISO_L_TX  (via drill 0.38)
  Top 0.305: U1.23 49.6,39.95 v49.78,40.13 | v61.21,35.31 61.21,28.7 61.98,27.94 R63.2
  Bottom 0.305: v49.78,40.13 56.39,40.13 v61.21,35.31
!ISO_RX  (via drill 0.38)
  Top 0.305: U1.8 45.45,31.98 43.94,30.48 43.94,29.72 42.16,27.94 31.5,27.94 v30.99,28.45 | v29.21,26.67 27.35,24.81 R24.1
  Top 0.406: R24.1 22.78,24.81 v21.84,23.88 | v25.15,16.26 25.4,16.51 25.4,17.27 24.89,17.79 U7.4
  Bottom 0.305: v30.99,28.45 v29.21,26.67
  Bottom 0.406: v21.84,23.88 21.84,19.56 v25.15,16.26
!RST
  Top 0.305: U1.26 47.65,40.23 47.33,40.55 R28.1
!STN_SLEEP  (via drill 0.38)
  Top 0.254: U4.11 14.16,13.53 v14.48,13.21
  Top 0.305: U1.9 47,31.51 46.74,31.24 45.72,31.24 44.7,30.23 44.7,29.72 42.42,27.43 30.23,27.43 29.72,27.94
  Top 0.406: v16.76,15.49 16.76,16.51 16.76,17.02 19.05,19.3 v19.05,27.94 | v27.94,27.94 29.72,27.94
  Bottom 0.254: v16.76,15.49 17.27,14.99 17.27,13.97 16,12.7 15.24,12.7 14.73,13.21 v14.48,13.21
  Bottom 0.406: v19.05,27.94 v27.94,27.94
AVR_RX
  Top 0.254: U4.14 14.88,14.88 15.75,15.75 15.75,17.53
  Top 0.406: 15.75,17.53 18.03,19.81 18.03,32 24.38,38.35 28.19,38.35 31.75,41.91 31.75,45.72 33.78,47.75 47.24,47.75 50.29,50.8 50.29,51.82 49.66,52.45 47.62,52.45 46.47,53.61 J3.32
AVR_TX
  Top 0.254: U4.15 14.31,15.33 14.99,16 14.99,17.78 15.49,18.29
  Top 0.406: 15.49,18.29 17.27,20.07 17.27,32.26 23.88,39.12 27.69,39.12 30.99,42.42 30.99,46.23 33.27,48.51 46.29,48.51 J3.33
BATT_V
  Top 0.305: U1.27 47,39.1 46.48,39.62 44.96,39.62 44.45,40.13 R22.1 C21.1 R43.1
BST
  Top 0.305: U3.10 47.25,7.25 47.65,7.65 C24.2
CAN_H
  Top 0.305: R80.2 32.89,9.02 33.63,9.76 J1.4 U2.7
CAN_L
  Top 0.305: R5.1 27.94,8.52 R81.2 30.61,9.02 32.37,10.78 J1.5 U2.6
CAN_RX  (via drill 0.38)
  Top 0.305: U1.11 48.3,31.03 47.37,30.1 47.37,26.8 43.94,23.37 v36.83,23.37 | U2.4 31.1,20.47 v31.5,20.07
  Bottom 0.305: v36.83,23.37 34.8,23.37 v31.5,20.07
CAN_TX
  Top 0.254: U1.12 48.95,29.57 R61.2
  Top 0.305: U2.1 44.45,22.61 48.01,26.16 48.01,29.21 48.26,29.46 48.84,29.46 R61.2
GND  (via drill 0.38, 0.5, 0.6)
  Top 0.254: U4.8 U4.0
  Top 0.305: U3.15 46.75,4.75 U3.EXP 46.75,5.25 U3.14
  other vias: 47,5 40,10 56.5,3 56.5,5 11.94,45.72 11.94,38.61 20.32,46.48 8.13,16.76 8.89,8.38 31.62,3.81 48.51,2.79 17.27,4.06 16.26,9.65 11.92,14.43 2.54,9.65 20.45,11.81 22.86,16.51 8.13,27.94 14.99,27.94 57.28,31.62 45.47,27.18 43.69,35.05 45.72,40.89 51.56,38.61 59.18,23.37 63.75,41.91 35.17,24.99 52.07,19.81 43.05,4.32 43.43,18.03 39.12,18.03 49.28,8.38 20.57,16.51 5.33,48.01
  pour Bottom (isolate 0.254, rank 6): 0,3 arc90 3,0 62,0 arc90 65,3 65,53 arc90 62,56 3,56 arc90 0,53 0,37.5 arc90 1,36.5 4,36.5 arc-90 5,35.5 5,20.5 arc-90 4,19.5 1,19.5 arc90 0,18.5
  pour Top (isolate 0.254, rank 6): 0,3 arc90 3,0 62,0 arc90 65,3 65,53 arc90 62,56 3,56 arc90 0,53 0,37.5 arc90 1,36.5 4,36.5 arc-90 5,35.5 5,20.5 arc-90 4,19.5 1,19.5 arc90 0,18.5
GPS_RX
  Top 0.406: J3.13 23.62,51.22 23.62,41.15 18.54,36.07 10.92,36.07 7.42,39.57 J5.3 7.42,40.59 5.47,42.54 J2.4
GPS_TX
  Top 0.406: J3.15 25.99,51.23 24.77,52.45 22.99,52.45 22.35,51.82 22.35,41.15 17.91,36.7 11.56,36.7 9.65,38.61 9.65,40.39 7.37,42.67 J5.2 6.45,43.54 J2.3
K-LINE  (via drill 0.38)
  Top 0.406: v39.37,15.75 39.98,16.36 R98.2 Q1.3 | R23.1 27.32,21.45 29.46,19.3 29.46,15.52 J1.6
  Bottom 0.406: v39.37,15.75 32.95,15.75 J1.6
L-LINE  (via drill 0.38)
  Top 0.406: v58.67,14.22 60.75,16.3 R99.2 Q2.3
  Bottom 0.406: v58.67,14.22 50.8,14.22 45.21,8.64 37.62,8.64 J1.3
MISO
  Top 0.254: J7.P$1 4.44,13.08 5.08,13.72 7.49,13.72 8,14.22 8,15.62 8.46,16.08 U4.20
N$1
  Top 0.406: U8.6 10.7,42.82 C9.1
N$2  (via drill 0.38)
  Top 0.254: U4.4 9.79,13.98 9.53,13.72 9.53,13.08 8.89,12.45 v8.89,11.94
  Top 0.406: R5.2 25.78,8.51 25.4,8.89 20.83,8.89 v20.57,9.14
  Bottom 0.254: v8.89,11.94 11.94,8.89 19.05,8.89 19.3,9.14 v20.57,9.14
N$3
  Top 0.305: U1.21 51.92,36.93 52.58,37.59 52.58,40.13 53.59,41.15 53.59,43.18 54.23,43.81 R71.1
N$4
  Top 0.254: Q1.1 57.08,22.78 R62.1
N$5
  Top 0.254: Q2.1 61.91,22.78 R63.1
N$6
  Top 0.406: R25.2 R26.1 22.49,13.57 21.77,14.29 U7.3
N$7
  Top 0.305: U1.20 52.03,36.28 53.59,37.85 53.59,39.37 54.86,40.64 R72.1
N$8
  Top 0.305: U1.15 52.06,33.03 52.32,32.77 52.32,31.5 53.16,30.66 R42.2
N$9
  Top 0.305: U1.1 R4.1
N$10
  Top 0.305: R80.1 C80.1
N$11
  Top 0.406: U2.8 36.64,16.86 R27.2
N$12
  Top 0.406: D3.A R70.1
N$13
  Top 0.406: R23.2 23.25,22.75 21.77,21.27 U7.1
N$14
  Top 0.305: U1.18 52.76,34.98 54.48,36.7 R41.1
N$15
  Top 0.305: U1.19 52.4,35.63 54.86,38.1 R40.1
N$16  (via drill 0.6)
  other vias: 10.92,19.81
N$17
  Top 0.254: D4.A 62.32,46.32 61.98,45.97 58.17,45.97 57.75,46.39 R73.1
N$18
  Top 0.305: U8.12 15.57,39.7 15.24,39.37 15.24,38.5 C30.2
N$20
  Top 0.305: U8.13 16.37,39.51 16.51,39.37 16.51,38.53 C30.1
N$23
  Top 0.305: J3.12 21.07,53.33 19.81,52.07 19.81,50.04 19.3,49.53 18.03,49.53 17.53,49.02 R6.2
N$24  (via drill 0.38)
  Top 0.305: R6.1 17.53,45.97 v17.78,45.72 | S1.P$1 34.04,46.48 v33.78,46.23
  Bottom 0.305: v17.78,45.72 29.97,45.72 32.26,43.43 34.04,43.43 34.54,43.94 34.54,45.47 v33.78,46.23
N$26
  Top 0.305: U1.17 52.28,34.33 53.05,33.56 C70.A
N$27
  Top 0.305: R81.1 C81.1
N$35
  Top 0.305: R71.2 D1.C
N$36
  Top 0.305: R72.2 D2.C
OBD_RX  (via drill 0.38)
  Top 0.305: J3.37 54.09,48.76 v51.56,46.23 | 49.78,30.23 v50.04,29.97 49.6,30.41 U1.13
  Bottom 0.305: v51.56,46.23 49.02,46.23 48.01,45.21 48.01,32 v50.04,29.97
OBD_TX  (via drill 0.38)
  Top 0.305: U1.14 50.25,31.28 51.21,30.33 R3.1 52.55,29.44 v52.83,29.72 52.58,29.46 | J3.36 51.64,53.77 52.83,52.58 52.83,49.02 v49.28,45.47
  Bottom 0.305: v49.28,45.47 48.77,44.96 48.77,33.78 v52.83,29.72
OSC1
  Top 0.254: U1.6 42.01,33.68 | C50.1
  Top 0.305: 42.01,33.68 40.39,35.31 37.59,35.31 37.24,34.95 Y1.3 C50.1
OSC2
  Top 0.254: 41.14,30.12 C51.1 | U1.7 41.92,33.03
  Top 0.305: Y1.1 41.14,30.12 | C51.1 41.16,32.27 41.92,33.03
REG_EN  (via drill 0.38)
  Top 0.254: U4.2 9.41,14.88 9.02,14.48 9.02,13.72 8,12.7 v8,10.92 | v49.78,6.35 49.78,7.37 49.53,7.62 48.51,7.62 47.75,6.86 U3.9
  Top 0.406: v8.38,6.86 9.65,5.59 9.65,3.56 10.92,2.29 34.04,2.29 v34.29,2.54
  Bottom 0.254: v8,10.92 8,7.24 v8.38,6.86
  Bottom 0.406: v34.29,2.54 45.97,2.54 v49.78,6.35
SCL
  Top 0.254: J7.P$3 5.71,12.83 6.1,13.21 7.62,13.21 8.51,14.1 8.51,14.86 8.98,15.33 U4.1
SCL1  (via drill 0.38)
  Top 0.305: R2.1 13.46,51.22 J3.5
  Top 0.406: U8.2 15.57,44.12 v15.24,44.45
  Bottom 0.406: v15.24,44.45 15.24,49.44 J3.5
SDA
  Top 0.254: U4.16 12.82,16.9 11.94,17.78 6.6,17.78 5.71,16.89 J7.P$4
SDA1  (via drill 0.38)
  Top 0.305: R1.1 10.92,51.22 J3.3
  Top 0.406: U8.3 14.77,43.65 v13.21,45.21
  Bottom 0.406: v13.21,45.21 13.21,48.93 J3.3
SHUTDOWN  (via drill 0.38)
  Top 0.254: U4.12 15.49,13.98 v15.75,13.72
  Top 0.406: J3.22 33.77,53.33 32.51,52.07 32.51,49.02 30.23,46.74 30.23,42.93 27.18,39.88 23.62,39.88 16.51,33.02 16.51,21.59 v15.49,20.57
  Bottom 0.406: v15.49,20.57 15.49,13.97 v15.75,13.72
UART1_RX  (via drill 0.38)
  Top 0.305: J3.10 18.53,53.84 19.81,55.12 26.67,55.12 27.43,54.36 v27.43,52.58
  Bottom 0.305: v27.43,52.58 27.43,48.21 J4.1
UART1_TX  (via drill 0.38)
  Top 0.305: v24.64,47.24 24.64,45.92 J4.2
  Bottom 0.305: J3.8 16.08,53.77 17.27,52.58 21.84,52.58 22.35,52.07 22.35,50.55 23.11,49.78 25.65,49.78 26.16,49.28 26.16,48.51 24.89,47.24 v24.64,47.24
USER_LED
  Top 0.254: J3.40 56.56,53.77 55.37,52.58 55.37,49.53 56.05,48.86 R73.2
VBATT  (via drill 0.38)
  Top 0.254: R44.2 12.33,7.99 v12.45,7.87 | C45.1 17.44,7.02 v17.27,6.86
  Top 0.305: U3.3 47.25,2.25 47,2 46.75,2.25 U3.2 | U3.11 46.75,7.25 v46.5,7.5 | v41.98,5 42,5
  Top 0.406: R99.1 56.27,11.9 R98.1 53.11,11.96 v52.58,11.43 | 19.41,7.13 24.65,7.13 v24.89,7.37 | v35.31,8.38 35.81,8.38 36.6,7.6 | 19.41,7.13 U6.1 21.22,10.81 21.46,11.05 | 19.41,7.13 C45.1 | 21.46,11.05 21.59,11.18 21.59,12.45 21.32,12.71 U6.3 19.3,12.82 19.3,18.29 19.81,18.8 19.81,27.43 20.32,27.94 20.32,32.77 24.89,37.34 31.24,37.34 36.55,42.65 41.8,42.65 R43.2 | 21.46,11.05 22.11,10.4 R25.1 25.39,10.4 26.42,11.43 26.42,18.8 25.53,19.69 U7.5 | C25.2 43.18,1
  Top 0.813: J1.2 36.17,12.62 J1.1 | J1.1 37.45,8.45 36.6,7.6 36,7 36,2 37,1 42,1 | 42,1 43.18,1 46,1 47,2 | C41.1 42,5 42,1 | D5.K 41.27,13.34 39.37,11.43 37.52,11.43 J1.1
  Bottom 0.254: v12.45,7.87 16.26,7.87 v17.27,6.86
  Bottom 0.305: v46.5,7.5 44,7.5 41.98,5.74 v41.98,5
  Bottom 0.406: v52.58,11.43 50.43,11.43 v46.5,7.5 | v24.89,7.37 34.29,7.37 v35.31,8.38
VBATT_MON
  Top 0.254: U4.5 10.27,12.81 9.59,12.13 C23.2 R21.1
  Top 0.305: R44.1 R21.1
VCC-AVR  (via drill 0.38)
  Top 0.254: U4.9 12.37,12.27 12.57,12.06 13.34,12.06 13.6,11.8 C22.1
  Top 0.406: C22.1 C3.1 | C3.1 16.69,10.81 U6.5 | v3.17,17.02 3.19,17.01 R20.1 4.11,15.8 4.32,16 4.32,15.5 J7.P$2 | v14.61,12.19 14.61,11.81 14.73,11.68 14.73,10.95 C3.1
  Bottom 0.406: v3.17,17.02 5.33,17.02 10.16,12.19 v14.61,12.19
VSW
  Top 0.305: U3.16 44.25,4.25 44,4.5 44,4.45 44.95,3.5 U3.1 | 44,6.73 44,6.5 45.5,6.5 | U3.13 44.25,5.75 44,5.75 | U3.12 45.5,6.5 | C24.1 46.35,8.48 45.5,7.63 45.5,6.5
  Top 0.61: 44,4.5 44,5.75
  Top 1.016: 44,5.75 44,6.5 | 44,6.73 44,9 43.95,12.5 L1.P$1

### Text on the board
tPlace: DashCam HAT | v1.1 | JMA SEP2017 | 5V | 3.3V
tNames: RX | TX | ttyS1 | GND